# EAGLE design DoorSensor-v1.0 (EAGLE 7.0.0)
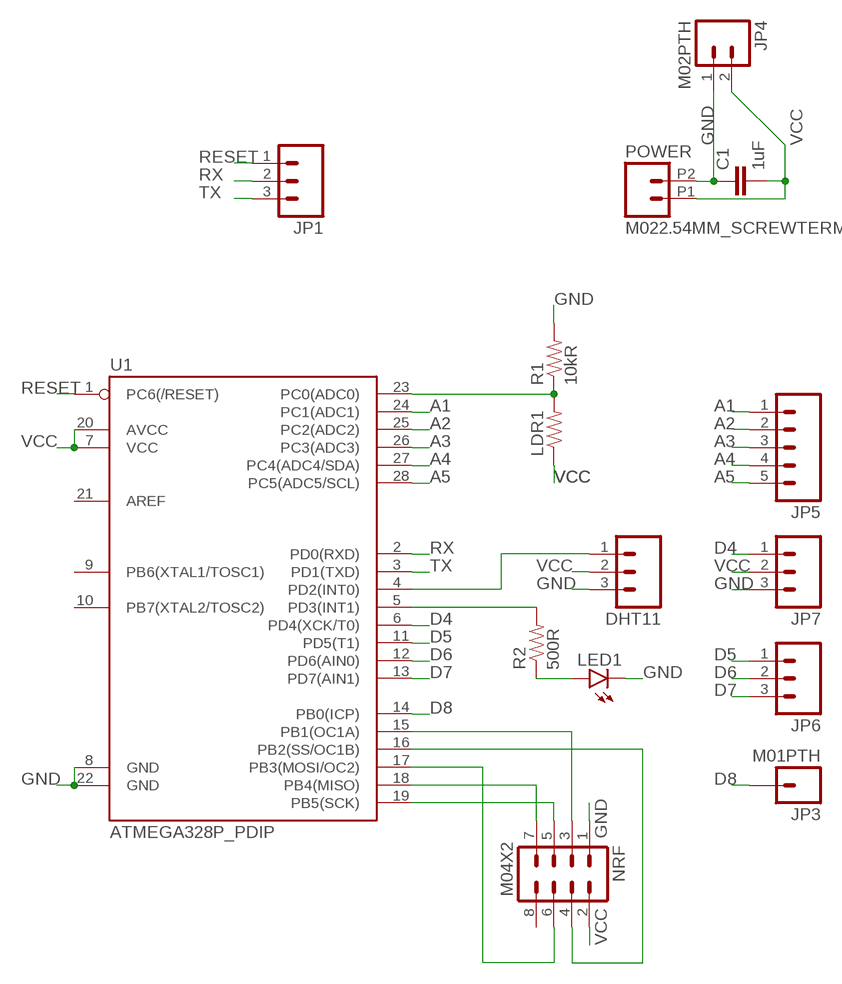
[diagram p0: schematic, sheet 1]

## Parts
C1  1uF  CAPPTH  [CAP-PTH-SMALL]
DHT11  M03PTH  [1X03]
JP1  M03PTH  [1X03]
JP3  M01PTH  [1X01]
JP4  M02PTH  [1X02]
JP5  M05PTH  [1X05]
JP6  M03PTH  [1X03]
JP7  M03PTH  [1X03]
LDR1  RESISTORKIT  [AXIAL-0.3-KIT]
LED1  LED3MM  [LED3MM]
NRF  M04X2  [2X4]
POWER  M022.54MM_SCREWTERM  [1X02_2.54_SCREWTERM]
R1  10kR  RESISTORKIT  [AXIAL-0.3-KIT]
R2  500R  RESISTORKIT  [AXIAL-0.3-KIT]
U1  ATMEGA328P_PDIP  [DIL28-3]

## Nets
A1: JP5.1 U1.24(PC1(ADC1))
A2: JP5.2 U1.25(PC2(ADC2))
A3: JP5.3 U1.26(PC3(ADC3))
A4: JP5.4 U1.27(PC4(ADC4/SDA))
A5: JP5.5 U1.28(PC5(ADC5/SCL))
D4: JP7.1 U1.6(PD4(XCK/T0))
D5: JP6.1 U1.11(PD5(T1))
D6: JP6.2 U1.12(PD6(AIN0))
D7: JP6.3 U1.13(PD7(AIN1))
D8: JP3.1 U1.14(PB0(ICP))
GND: C1.1 DHT11.3 JP4.1 JP7.3 LED1.K(C) NRF.1 POWER.P2 R1.P$2 U1.8(GND) U1.22(GND)
N$1: LDR1.P$2 R1.P$1 U1.23(PC0(ADC0))
N$2: LED1.A R2.P$1
N$3: DHT11.1 U1.4(PD2(INT0))
N$4: R2.P$2 U1.5(PD3(INT1))
N$5: NRF.3 U1.15(PB1(OC1A))
N$6: NRF.4 U1.16(PB2(SS/OC1B))
N$7: NRF.5 U1.19(PB5(SCK))
N$9: NRF.7 U1.18(PB4(MISO))
N$10: NRF.6 U1.17(PB3(MOSI/OC2))
RESET: JP1.1 U1.1(PC6(/RESET))
RX: JP1.2 U1.2(PD0(RXD))
TX: JP1.3 U1.3(PD1(TXD))
VCC: C1.2 DHT11.2 JP4.2 JP7.2 LDR1.P$1 NRF.2 POWER.P1 U1.7(VCC) U1.20(AVCC)
Unconnected: NRF.8 U1.9(PB6(XTAL1/TOSC1)) U1.10(PB7(XTAL2/TOSC2)) U1.21(AREF)

## Library data of the parts
C1 = SparkFun-Passives:CAP: Capacitor Standard 0603 ceramic capacitor, and 0.1" leaded capacitor.
DHT11 JP1 JP6 JP7 = SparkFun-Connectors:M03: Header 3 Standard 3-pin 0.1" header. Use with straight break away headers (SKU : PRT-00116), right angle break away headers (PRT-00553), swiss pins (PRT-00743), machine pins (PRT-00117), and female headers (PRT-00115). Molex polarized connector foot print use with SKU : PRT-08232 with associated crimp pins and housings.
JP3 = SparkFun-Connectors:M01: Header 1 Standard 1-pin 0.1" header. Use with straight break away headers (SKU : PRT-00116), right angle break away headers (PRT-00553), swiss pins (PRT-00743), machine pins (PRT-00117), and female headers (PRT-00115).
JP4 POWER = SparkFun-Connectors:M02: Standard 2-pin 0.1" header. Use with - straight break away headers ( PRT-00116) - right angle break away headers (PRT-00553) - swiss pins (PRT-00743) - machine pins (PRT-00117) - female headers (PRT-00115) Molex polarized connector foot print use with: PRT-08233 with associated crimp pins and housings. 2.54_SCREWTERM for use with PRT-10571. 3.5mm Screw Terminal footprints for PRT-08084 5mm Screw Terminal footprints for use with PRT-08433
JP5 = SparkFun-Connectors:M05: Header 5 Standard 5-pin 0.1" header. Use with straight break away headers (SKU : PRT-00116), right angle break away headers (PRT-00553), swiss pins (PRT-00743), machine pins (PRT-00117), and female headers (PRT-00115). Molex polarized connector foot print use with SKU : PRT-08230 with associated crimp pins and housings.
LDR1 R1 R2 = SparkFun-Passives:RESISTOR: Resistor Basic schematic elements and footprints for 0603, 1206, and PTH resistors.
LED1 = SparkFun-LED:LED: LEDs Standard schematic elements and footprints for 5mm, 3mm, 1206, and 0603 sized LEDs. 5mm - Spark Fun Electronics SKU : COM-00529 (and others)
NRF = SparkFun-Connectors:M04X2: .1" header, two rows of four.
U1 = SparkFun-DigitalIC:ATMEGA328P_PDIP: uC used in the Arduino 32kb flash, 1k EEPROM, 2k SRAM This is the through-hole version of this chip.

## Board
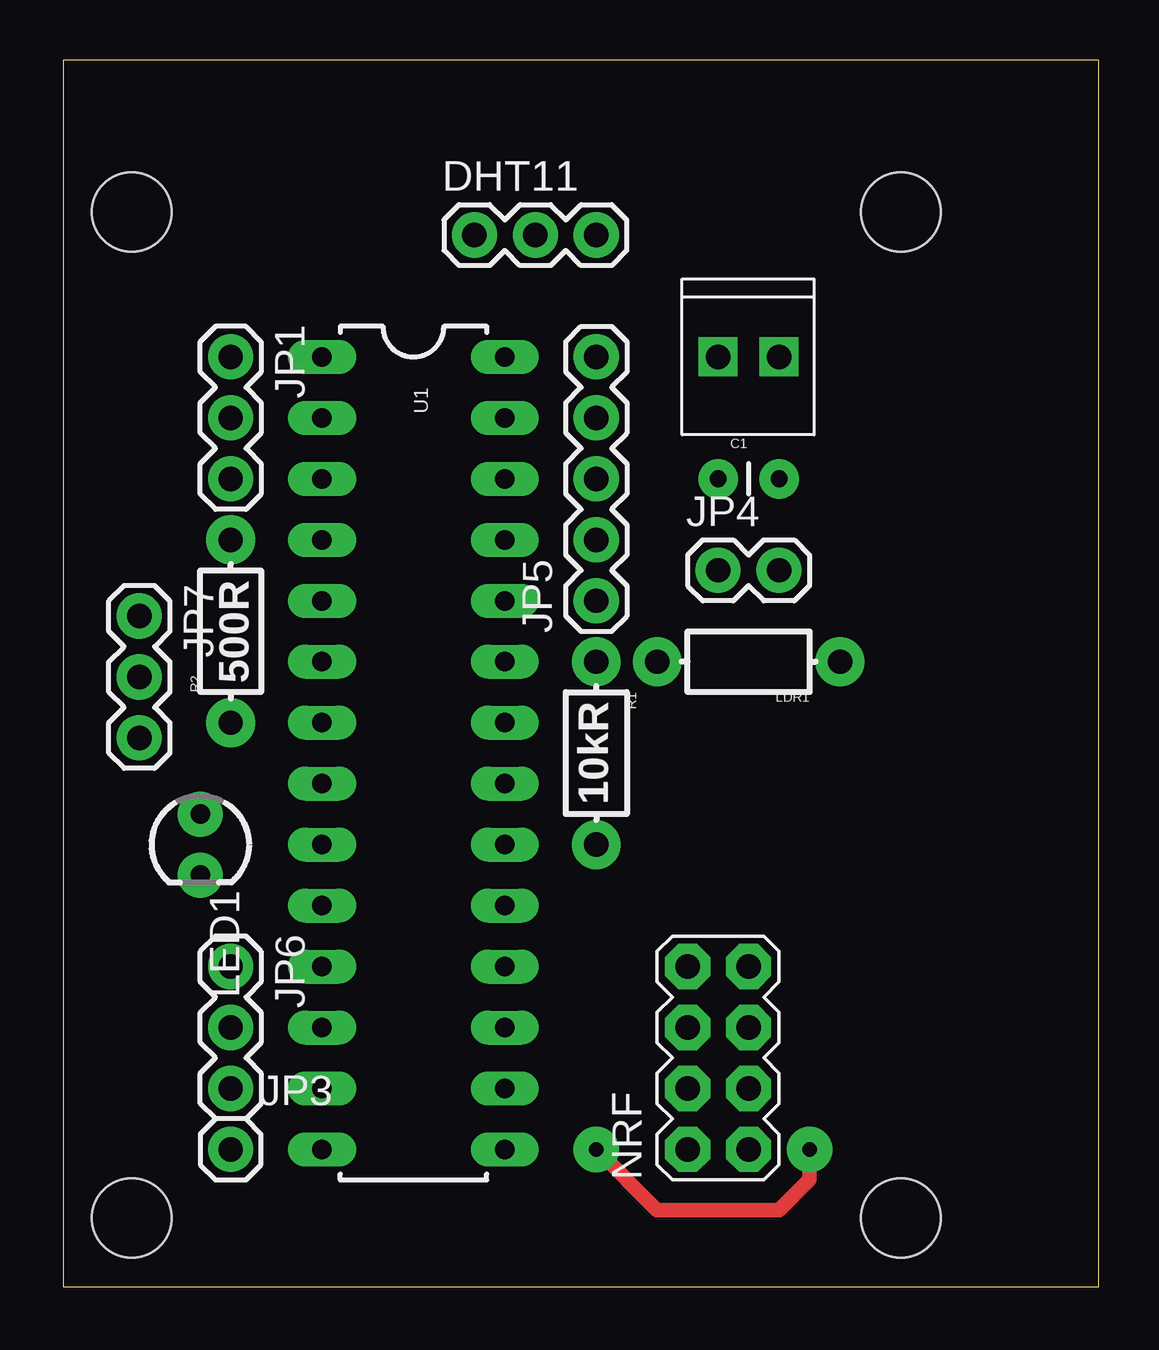
[diagram p1: board, top side]
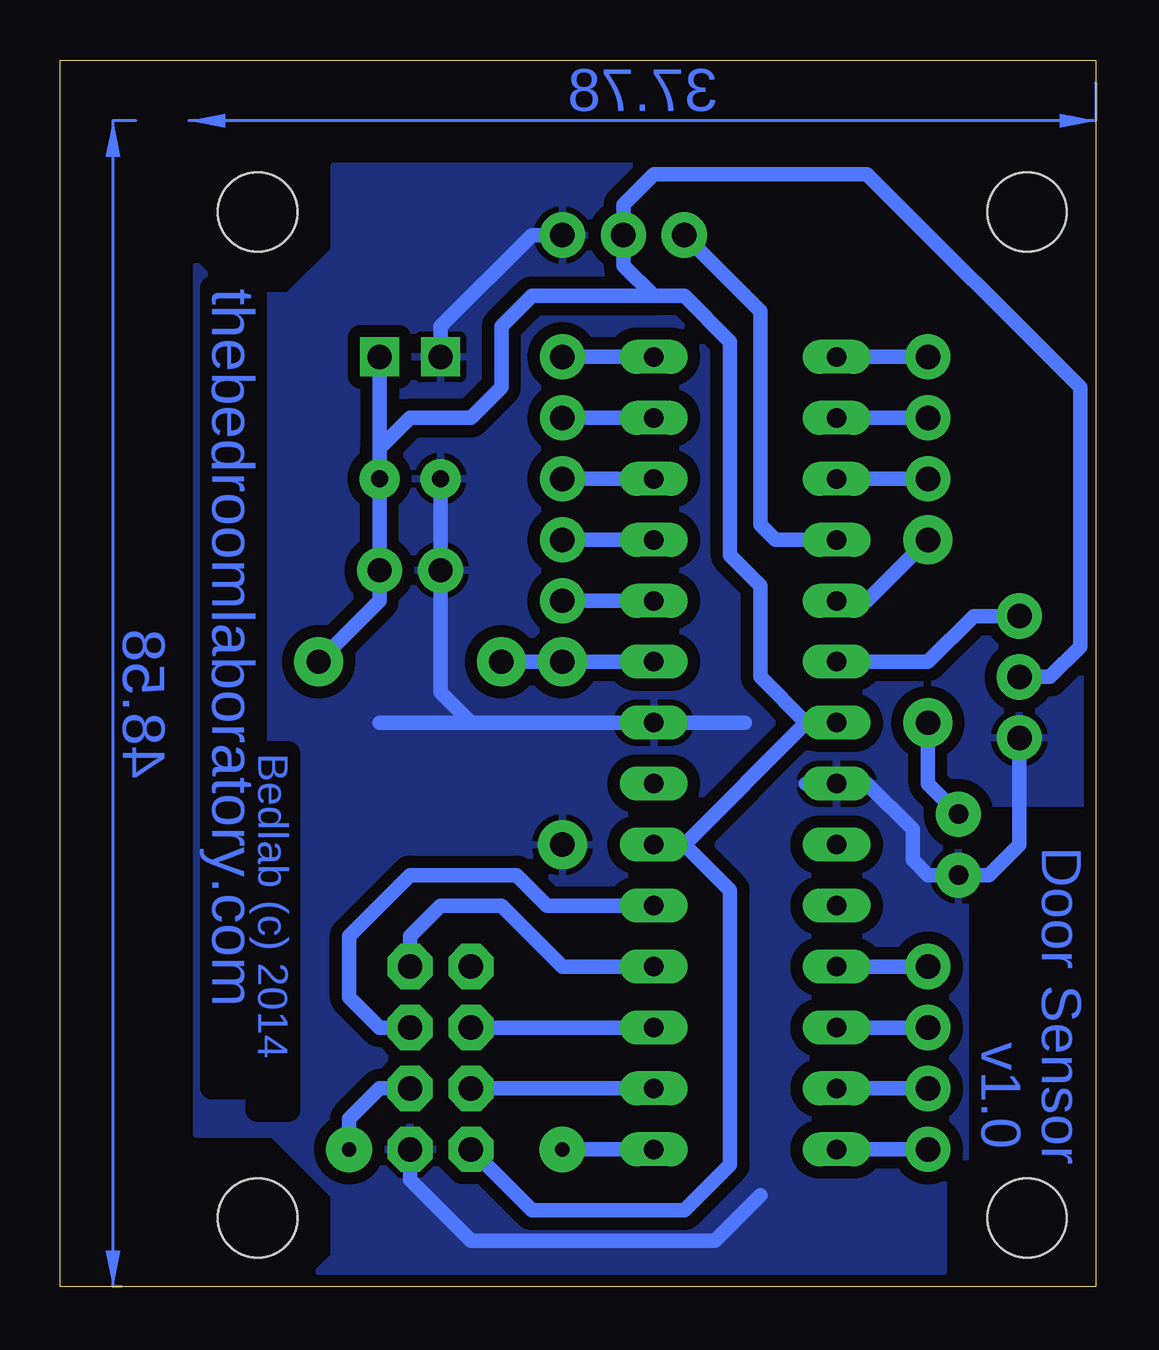
[diagram p2: board, bottom side, seen from below]

Size 43.17 x 51.11 mm. Coordinates in mm from the lower left corner, seen from the top.
Outline: 0,0 43.17,0 43.17,51.11 0,51.11 0,0
Copper layers (1*16): Top 0.035mm / dielectric 1.5mm / Bottom 0.035mm
Design rules "SparkFun-Home": minimum track width 24mil, minimum drill 20mil, track to track 20mil, track to pad 20mil, pad to pad 20mil, via to via 20mil, smd to smd 8mil, copper to edge 10mil, drill to drill 8mil, minimum pad ring 12mil, minimum via ring 10mil, stop-mask expansion 4mil, vias tented up to drill 25mil, thermal gap 10mil

### Footprints (pad centres in the part's own frame; a part is rotated, then mirrored left to right if it is on the bottom)
CAP-PTH-SMALL = drill 0.7 pad 1.651: 1 0,0; 2 2.54,0
1X03 = drill 1.016 pad 1.88: 1 0,0; 2 2.54,0; 3 5.08,0
1X01 = drill 1.016 pad 1.88: 1 0,0
1X02 = drill 1.016 pad 1.88: 1 0,0; 2 2.54,0
1X05 = drill 1.016 pad 1.88: 1 0,0; 2 2.54,0; 3 5.08,0; 4 7.62,0; 5 10.16,0
AXIAL-0.3-KIT = drill 1.016 pad 2.032: P$1 -3.81,0; P$2 3.81,0
LED3MM = drill 0.813 pad 1.88: A -1.27,0; K 1.27,0
2X4 = drill 1.016 pad 1.88 octagon: 1 -3.81,-1.27; 2 -3.81,1.27; 3 -1.27,-1.27; 4 -1.27,1.27; 5 1.27,-1.27; 6 1.27,1.27; 7 3.81,-1.27; 8 3.81,1.27
1X02_2.54_SCREWTERM = drill 1.016 square: P1 2.54,0; P2 0,0
DIL28-3 = drill 0.813 long: 1 -16.51,-3.81; 2 -13.97,-3.81; 3 -11.43,-3.81; 4 -8.89,-3.81; 5 -6.35,-3.81; 6 -3.81,-3.81; 7 -1.27,-3.81; 8 1.27,-3.81; 9 3.81,-3.81; 10 6.35,-3.81; 11 8.89,-3.81; 12 11.43,-3.81; 13 13.97,-3.81; 14 16.51,-3.81; 15 16.51,3.81; 16 13.97,3.81; 17 11.43,3.81; 18 8.89,3.81; 19 6.35,3.81; 20 3.81,3.81; 21 1.27,3.81; 22 -1.27,3.81; 23 -3.81,3.81; 24 -6.35,3.81; 25 -8.89,3.81; 26 -11.43,3.81; 27 -13.97,3.81; 28 -16.51,3.81
STAND-OFF = hole 3.302: 0,0

### Placement (x,y rotation side)
C1  27.3,33.66 0 top
DHT11  17.14,43.81 0 top
JP1  6.99,38.73 270 top
JP3  6.99,5.71 0 top
JP4  27.3,29.84 0 top
JP5  22.23,28.57 90 top
JP6  6.99,13.34 270 top
JP7  3.17,27.94 270 top
LDR1  28.57,26.04 180 top
LED1  5.71,18.41 270 top
NRF  27.3,9.53 90 top
POWER  27.3,38.73 0 top
R1  22.23,22.23 270 top
R2  6.99,27.3 90 top
U1  14.61,22.23 270 top
U$1  [STAND-OFF]  34.92,44.77 0 top
U$2  [STAND-OFF]  2.86,44.77 0 top
U$3  [STAND-OFF]  2.86,2.86 0 top
U$4  [STAND-OFF]  34.92,2.86 0 top

### Tracks (layer width: path | path; a pad name or v marks a point on that pad's centre or on a via)
A1
  Bottom 0.61: U1.24 JP5.1
A2
  Bottom 0.61: U1.25 JP5.2
A3
  Bottom 0.61: U1.26 JP5.3
A4
  Bottom 0.61: U1.27 JP5.4
A5
  Bottom 0.61: U1.28 JP5.5
D4
  Bottom 0.61: JP7.1 5.08,27.94 6.99,26.04 U1.6
D5
  Bottom 0.61: JP6.1 U1.11
D6
  Bottom 0.61: JP6.2 U1.12
D7
  Bottom 0.61: JP6.3 U1.13
D8
  Bottom 0.61: JP3.1 U1.14
GND
  Bottom 0.61: C1.1 JP4.1 27.3,24.77 26.04,23.5 | 26.04,23.5 U1.22 14.61,23.5 | 29.84,23.5 26.04,23.5 | POWER.P2 27.3,40.01 23.5,43.81 DHT11.3 | 13.97,3.81 15.88,1.91 26.04,1.91 28.57,4.45 NRF.1 | 12.06,20.95 U1.8 9.53,20.95 7.62,19.05 7.62,17.78 6.99,17.14 LED1.K 4.45,17.14 3.17,18.41 JP7.3
  pour Bottom: 5.71,46.67 6.35,46.35 6.35,43.81 3.81,41.27 0.64,41.27 0.64,5.71 1.27,6.35 4.45,6.35 6.35,4.45 6.35,0.64 32.38,0.64 31.75,1.27 31.75,3.81 34.29,6.35 37.47,6.35 37.47,42.55 36.2,41.27 33.66,41.27 31.75,43.18 31.75,46.67
N$1
  Bottom 0.61: U1.23 R1.P$1 LDR1.P$2
N$2
  Bottom 0.61: LED1.A 6.99,20.95 R2.P$1
N$3
  Bottom 0.61: U1.4 13.34,31.11 13.97,31.75 13.97,40.64 DHT11.1
N$4
  Bottom 0.61: R2.P$2 9.53,28.57 U1.5
N$5  (via drill 0.6 pad 1.91)
  Top 0.61: v22.23,5.71 24.77,3.17 29.84,3.17 31.11,4.45 v31.11,5.71
  Bottom 0.61: U1.15 v22.23,5.71 | NRF.3 29.84,8.26 31.11,6.99 v31.11,5.71
N$6
  Bottom 0.61: U1.16 NRF.4
N$7
  Bottom 0.61: NRF.5 29.84,10.79 31.11,12.06 31.11,14.61 28.57,17.14 24.13,17.14 22.86,15.88 U1.19
N$9
  Bottom 0.61: U1.18 22.23,13.34 24.77,15.88 27.3,15.88 28.57,14.61 NRF.7
N$10
  Bottom 0.61: U1.17 NRF.6
RESET
  Bottom 0.61: JP1.1 U1.1
RX
  Bottom 0.61: JP1.2 U1.2
TX
  Bottom 0.61: JP1.3 U1.3
VCC
  Bottom 0.61: U1.7 12.06,23.5 | 18.41,41.27 17.14,41.27 15.24,39.37 15.24,30.48 13.97,29.21 13.97,25.4 12.06,23.5 | 18.41,41.27 19.68,42.55 DHT11.2 19.68,45.09 18.41,46.35 9.53,46.35 0.64,37.47 0.64,26.67 1.91,25.4 JP7.2 | NRF.2 23.5,3.17 17.14,3.17 15.24,5.08 15.24,16.51 17.14,18.41 | 29.84,34.92 C1.2 JP4.2 29.84,28.57 LDR1.P$1 | POWER.P1 29.84,34.92 | 29.84,34.92 28.57,36.2 26.04,36.2 24.77,37.47 24.77,40.01 23.5,41.27 18.41,41.27 | 12.06,23.5 17.14,18.41 | 17.14,18.41 U1.20
(copper drawn outside any net)
  shapes: Bottom area x2

### Text on the board
Bottom: thebedroomlaboratory.com | Bedlab (c) 2014 | Door Sensor / v1.0